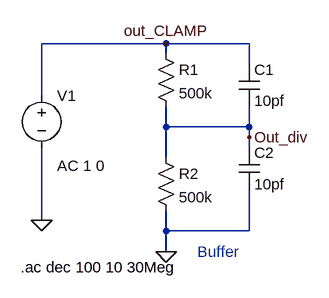
[diagram p0: schematic TEST.asc]
TEST.asc, the LTspice schematic file:
Version 4
SHEET 1 880 680
WIRE 80 32 -112 32
WIRE 208 32 80 32
WIRE 80 48 80 32
WIRE 208 64 208 32
WIRE -112 112 -112 32
WIRE 80 160 80 128
WIRE 208 160 208 128
WIRE 208 160 80 160
WIRE 208 176 208 160
WIRE 208 192 208 176
WIRE 80 208 80 160
WIRE -112 304 -112 192
WIRE 80 320 80 288
WIRE 208 320 208 256
WIRE 208 320 80 320
WIRE 80 352 80 320
FLAG 80 32 out_CLAMP
FLAG 208 176 Out_div
FLAG 80 352 0
FLAG -112 304 0
SYMBOL res 64 32 R0
SYMATTR InstName R1
SYMATTR Value 500k
SYMBOL res 64 192 R0
SYMATTR InstName R2
SYMATTR Value 500k
SYMBOL cap 192 64 R0
SYMATTR InstName C1
SYMATTR Value 10pf
SYMBOL cap 192 192 R0
SYMATTR InstName C2
SYMATTR Value 10pf
SYMBOL voltage -112 96 R0
WINDOW 123 24 124 Left 2
WINDOW 39 0 0 Left 2
SYMATTR Value2 AC 1 0
SYMATTR InstName V1
SYMATTR Value ""
TEXT 128 352 Left 2 ;Buffer
TEXT -144 376 Left 2 !.ac dec 100 10 30Meg

The netlist it stands for:
* TEST.asc
R1 out_CLAMP Out_div 500k
R2 Out_div 0 500k
C1 out_CLAMP Out_div 10pf
C2 Out_div 0 10pf
V1 out_CLAMP 0 AC 1 0
* Buffer
.ac dec 100 10 30Meg
.backanno
.end